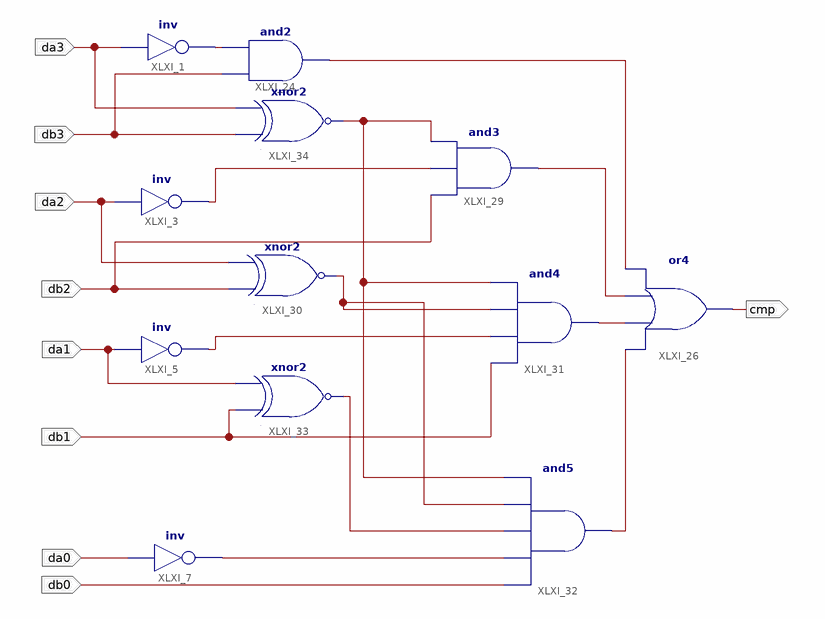
[diagram p0: schematic sheet 1]
// Xilinx ISE schematic data_comparator.sch (xc9500xl) as structural Verilog: 12 symbols, 9 ports
module data_comparator (
  input  da2,
  input  da1,
  input  db1,
  input  da3,
  input  db3,
  input  db2,
  input  da0,
  input  db0,
  output cmp
);

  wire XLXN_1, XLXN_9, XLXN_59, XLXN_74, XLXN_76, XLXN_83, XLXN_84, XLXN_85, XLXN_99, XLXN_114, XLXN_118;

  not XLXI_1 (XLXN_1, da3);
  not XLXI_3 (XLXN_74, da2);
  not XLXI_5 (XLXN_85, da1);
  not XLXI_7 (XLXN_9, da0);
  and XLXI_24 (XLXN_59, db3, XLXN_1);
  or XLXI_26 (cmp, XLXN_118, XLXN_99, XLXN_76, XLXN_59);
  and XLXI_29 (XLXN_76, db2, XLXN_74, XLXN_83);
  xnor XLXI_30 (XLXN_84, db2, da2);
  and XLXI_31 (XLXN_99, db1, XLXN_85, XLXN_84, XLXN_83);
  and XLXI_32 (XLXN_118, db0, XLXN_9, XLXN_114, XLXN_84, XLXN_83);
  xnor XLXI_33 (XLXN_114, db1, da1);
  xnor XLXI_34 (XLXN_83, db3, da3);
endmodule
